# Altium schematic sheet Linear-Regulator.SchDoc
size A; SheetNumber: 9; SheetTotal: 9
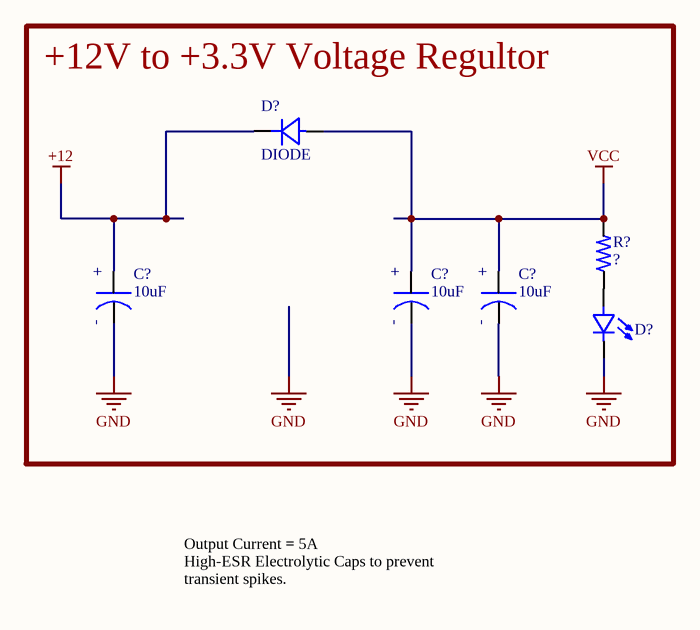
[diagram p0: Linear-Regulator.SchDoc]

## Parts
(Parts that share a designator on the sheet are numbered #1, #2 ... from top to bottom, then left to right.)
C?#1  value 10uF  [CAP_CAN_POLY]  (hidden comment: CAP)
C?#2  value 10uF  [CAP_CAN_POLY]  (hidden comment: CAP)
C?#3  value 10uF  [CAP_CAN_POLY]  (hidden comment: CAP)
D?#1  DIODE  [DO-214AC]
D?#2  LED - single  [LED - 0603]  (value not drawn)
R?  RES  [0402R]  (value not drawn)

## Blocks framed on the sheet
+12V to +3.3V Voltage Regultor: C?#1-C?#3 D?#1 D?#2 R?

## Nets
+12: C?#1.1 D?#1.K
GND: C?#1.2 C?#2.2 C?#3.2 D?#2.2(C)
VCC: C?#2.1 C?#3.1 D?#1.A R?.2
NetD?#2_1: D?#2.1(A) R?.1

## Notes on the sheet
- Output Current = 5A
  High-ESR Electrolytic Caps to prevent transient spikes.
- (in symbol CAP - POLARIZED) +; -

## Library data of the parts
C?#1-C?#3 = CAP - POLARIZED: Capacitor; MFR: *; MFR PN: *; Vendor: *; Vendor PN: *; Vendor Link: *
D?#1 = DIODE: DIODE GEN PURP; MFR: *; MFR PN: *; Value: *; Type: *
D?#2 = LED - single: LED; Color: Green; Type: SMD; MFR: *; MFR PN: *; Vendor: *; Vendor PN: *; Vendor Link: *
R? = RES: Resistor; MFR PN: *; MFR: *; Vendor: *; Vendor PN: *; Vendor Link: *; Value: ?